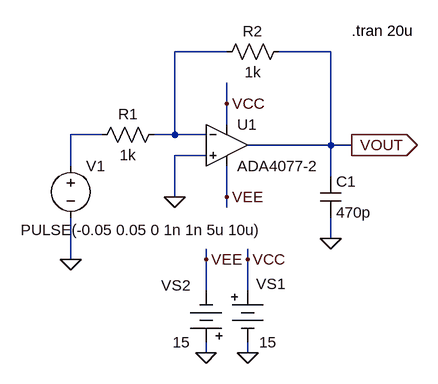
[diagram p0: schematic fig-03-01-15(a).asc]
fig-03-01-15(a).asc, the LTspice schematic file:
Version 4
SHEET 1 880 680
WIRE 208 32 128 32
WIRE 368 32 288 32
WIRE 208 112 208 80
WIRE 208 144 208 112
WIRE 16 160 -32 160
WIRE 128 160 128 32
WIRE 128 160 96 160
WIRE 176 160 128 160
WIRE 368 176 368 32
WIRE 368 176 240 176
WIRE 400 176 368 176
WIRE 176 192 128 192
WIRE -32 208 -32 160
WIRE 368 224 368 176
WIRE 128 256 128 192
WIRE 208 256 208 208
WIRE 208 272 208 256
WIRE 368 320 368 288
WIRE -32 352 -32 288
WIRE 176 352 176 336
WIRE 240 352 240 336
WIRE 176 400 176 352
WIRE 240 400 240 352
WIRE 176 496 176 480
WIRE 240 496 240 480
FLAG 128 256 0
FLAG -32 352 0
FLAG 400 176 VOUT
IOPIN 400 176 Out
FLAG 176 496 0
FLAG 240 496 0
FLAG 176 352 VEE
FLAG 240 352 VCC
FLAG 208 112 VCC
FLAG 208 256 VEE
FLAG 368 320 0
SYMBOL res 304 16 R90
WINDOW 0 0 56 VBottom 2
WINDOW 3 32 56 VTop 2
SYMATTR InstName R2
SYMATTR Value 1k
SYMBOL Misc\\battery 240 384 R0
WINDOW 0 13 6 Left 2
WINDOW 3 18 96 Left 2
SYMATTR InstName VS1
SYMATTR Value 15
SYMBOL Misc\\battery 176 496 R180
WINDOW 0 24 104 Left 2
WINDOW 3 24 16 Left 2
SYMATTR InstName VS2
SYMATTR Value 15
SYMBOL Opamps\\ADA4077-2 208 112 R0
SYMATTR InstName U1
SYMBOL res 112 144 R90
WINDOW 0 0 56 VBottom 2
WINDOW 3 32 56 VTop 2
SYMATTR InstName R1
SYMATTR Value 1k
SYMBOL voltage -32 192 R0
WINDOW 3 -77 115 Left 2
WINDOW 123 0 0 Left 0
WINDOW 39 0 0 Left 0
SYMATTR Value PULSE(-0.05 0.05 0 1n 1n 5u 10u)
SYMATTR InstName V1
SYMBOL cap 352 224 R0
SYMATTR InstName C1
SYMATTR Value 470p
TEXT 400 0 Left 2 !.tran 20u

The netlist it stands for:
* fig-03-01-15(a).asc
R2 VOUT N001 1k
VS1 VCC 0 15
VS2 0 VEE 15
XU1 0 N001 VCC VEE VOUT ADA4077-2  ; pins In+ In- V+ V- OUT
R1 N001 N002 1k
V1 N002 0 PULSE(-0.05 0.05 0 1n 1n 5u 10u)
C1 VOUT 0 470p
.tran 20u
.backanno
.end